# Altium schematic sheet CAN_Transceiver.SchDoc: CAN Transceiver
size 279 x 215 mm; Engineer: Prasoon Sinha; Revision: A; SheetNumber: 2; SheetTotal: 3
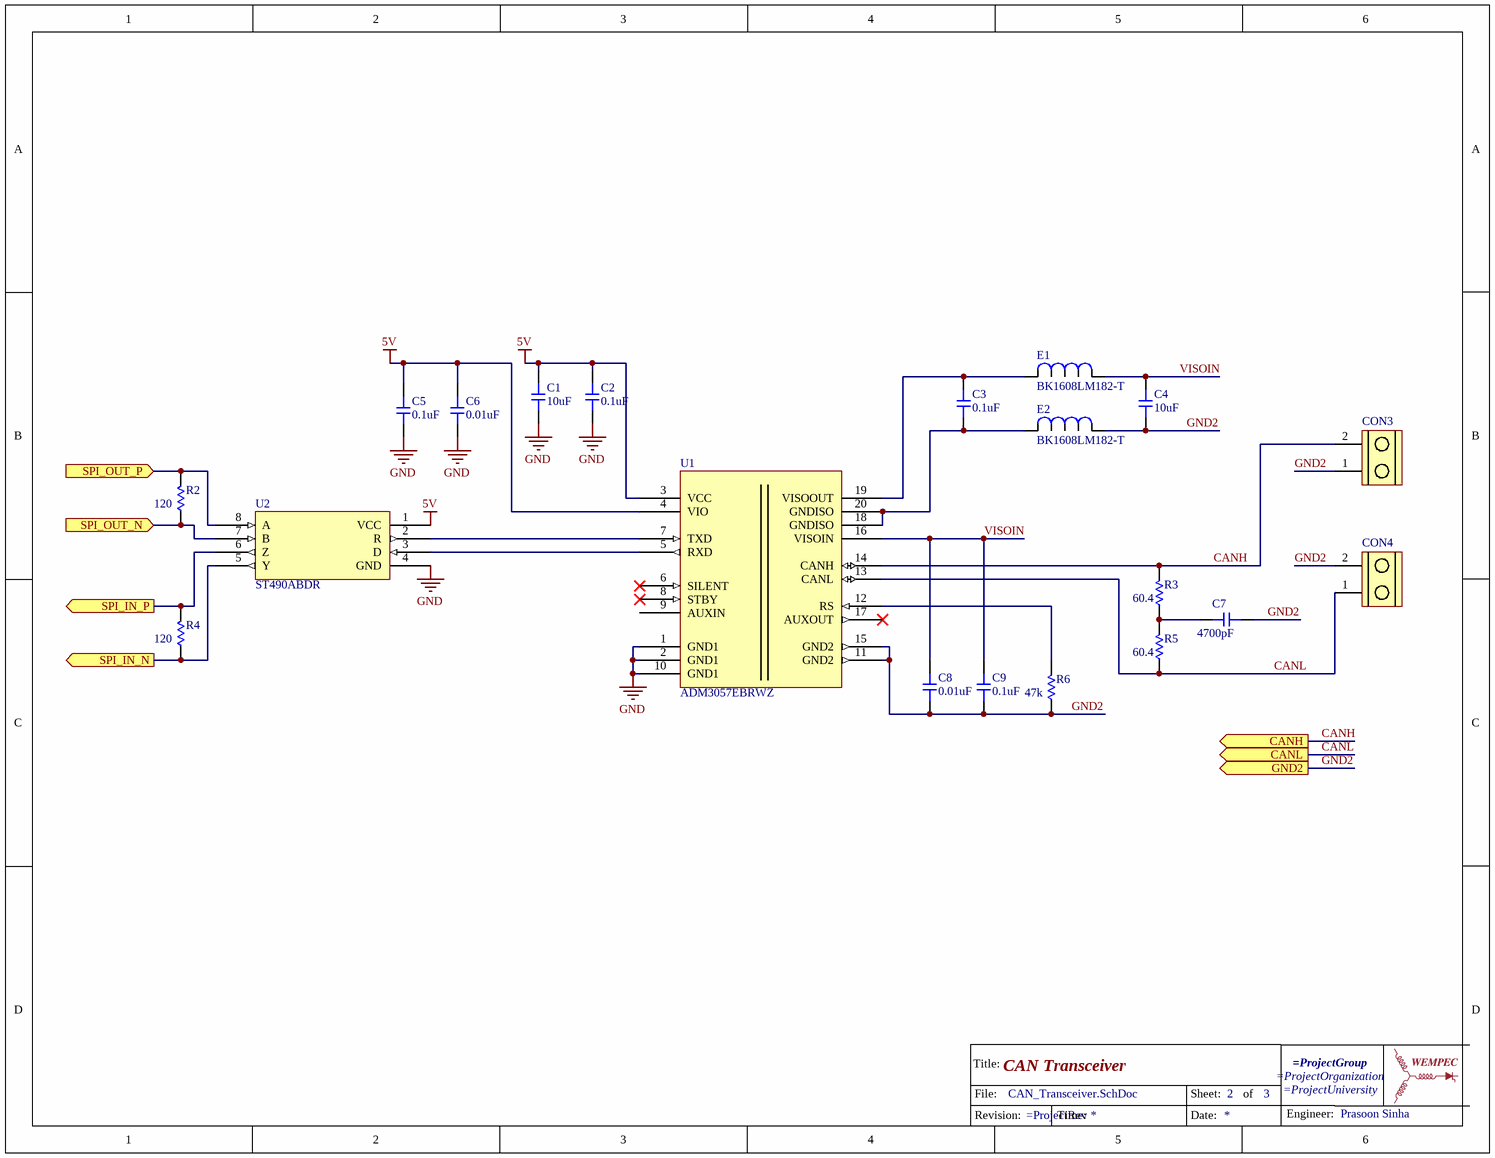
[diagram p0: CAN_Transceiver.SchDoc]

## Parts
*?  TitleBlockWEMPEC  (value not drawn)  (graphical)
C1  value 10uF  [0603_CAP]  (hidden comment: Capacitor)
C2  value 0.1uF  [0603_CAP]  (hidden comment: Capacitor)
C3  value 0.1uF  [0603_CAP]  (hidden comment: Capacitor)
C4  value 10uF  [0603_CAP]  (hidden comment: Capacitor)
C5  value 0.1uF  [0603_CAP]  (hidden comment: Capacitor)
C6  value 0.01uF  [0603_CAP]  (hidden comment: Capacitor)
C7  value 4700pF  [0603_CAP]  (hidden comment: Capacitor)
C8  value 0.01uF  [0603_CAP]  (hidden comment: Capacitor)
C9  value 0.1uF  [0603_CAP]  (hidden comment: Capacitor)
CON3  ScrewTerminal_1x2  [1935161]  (value not drawn)
CON4  ScrewTerminal_1x2  [1935161]  (value not drawn)
E1  BK1608LM182-T  [BK0603_TAY]
E2  BK1608LM182-T  [BK0603_TAY]
R2  value 120  [0603_RES]  (hidden comment: Resistor)
R3  value 60.4  [0603_RES]  (hidden comment: Resistor)
R4  value 120  [0603_RES]  (hidden comment: Resistor)
R5  value 60.4  [0603_RES]  (hidden comment: Resistor)
R6  value 47k  [0603_RES]  (hidden comment: Resistor)
U1  ADM3057EBRWZ  [RW-20_ADI]
U2  ST490ABDR  [SO-8_STM]

## Ports
CANH (out), CANL (out), GND2 (out), SPI_IN_N (out), SPI_IN_P (out), SPI_OUT_N (in), SPI_OUT_P (in)

## Nets
5V: C1.2 C2.2 C5.2 C6.2 U1.3(VCC) U1.4(VIO) U2.1(VCC)
GND: C1.1 C2.1 C5.1 C6.1 U1.1(GND1) U1.2(GND1) U1.10(GND1) U2.4(GND)
CANH: CON3.2 R3.2 U1.14(CANH) ; port CANH
CANL: CON4.1 R5.1 U1.13(CANL) ; port CANL
GND2: C4.1 C7.2 C8.1 C9.1 CON3.1 CON4.2 E2.1 R6.1 U1.11(GND2) U1.15(GND2) ; port GND2
SPI_IN_N: R4.1 U2.5(Y) ; port SPI_IN_N
SPI_IN_P: R4.2 U2.6(Z) ; port SPI_IN_P
SPI_OUT_N: R2.1 U2.7(B) ; port SPI_OUT_N
SPI_OUT_P: R2.2 U2.8(A) ; port SPI_OUT_P
VISOIN: C4.2 C8.2 C9.2 E1.1 U1.16(VISOIN)
NetC3_1: C3.1 E2.2 U1.18(GNDISO) U1.20(GNDISO)
NetC3_2: C3.2 E1.2 U1.19(VISOOUT)
NetC7_1: C7.1 R3.1 R5.2
NetR6_2: R6.2 U1.12(RS)
NetU1_5: U1.5(RXD) U2.3(D)
NetU1_7: U1.7(TXD) U2.2(R)

Not connected (* = marked no-connect by the designer): U1 6(SILENT)* 8(STBY)* 9(AUXIN) 17(AUXOUT)*

## Notes on the sheet
- (in symbol TitleBlockWEMPEC) Title:; File:; Sheet:; of; Engineer:; Revision:; Time:; Date:

## Library data of the parts
E1 E2 = BK1608LM182-T: FERRITE BEAD 1.8 KOHM 0603 1LN; Supplier 1: Digi-Key; Supplier Part Number 1: 587-1892-1-ND
U1 = ADM3057EBRWZ: Transceiver, Isolated 20-SOIC; Supplier Part Number 1: ADM3057EBRWZ-ND; Supplier 1: Digi-Key
U2 = ST490ABDR: 1/1 Transceiver Full RS422, RS485 8-SO; Supplier 1: Digi-Key; Supplier Part Number 1: 497-2091-1-ND
C1-C9 = Capacitor: Supplier 1: Digi-Key
  C1 C4: Supplier Part Number 1: 490-18214-1-ND
  C2 C3 C5 C9: Supplier Part Number 1: 1292-1390-1-ND
  C6 C8: Supplier Part Number 1: 399-8985-1-ND
  C7: Supplier Part Number 1: 399-9087-1-ND
CON3 CON4 = ScrewTerminal_1x2: Supplier 1: Digi-Key; Supplier Part Number 1: 277-1667-ND
R2-R6 = Resistor: Supplier 1: Digi-Key
  R2 R4: Supplier Part Number 1: 311-120HRCT-ND
  R3 R5: Supplier Part Number 1: 541-5507-1-ND
  R6: Supplier Part Number 1: 541-47.0KHCT-ND